# Altium schematic sheet 01_TOP.SchDoc
size A4
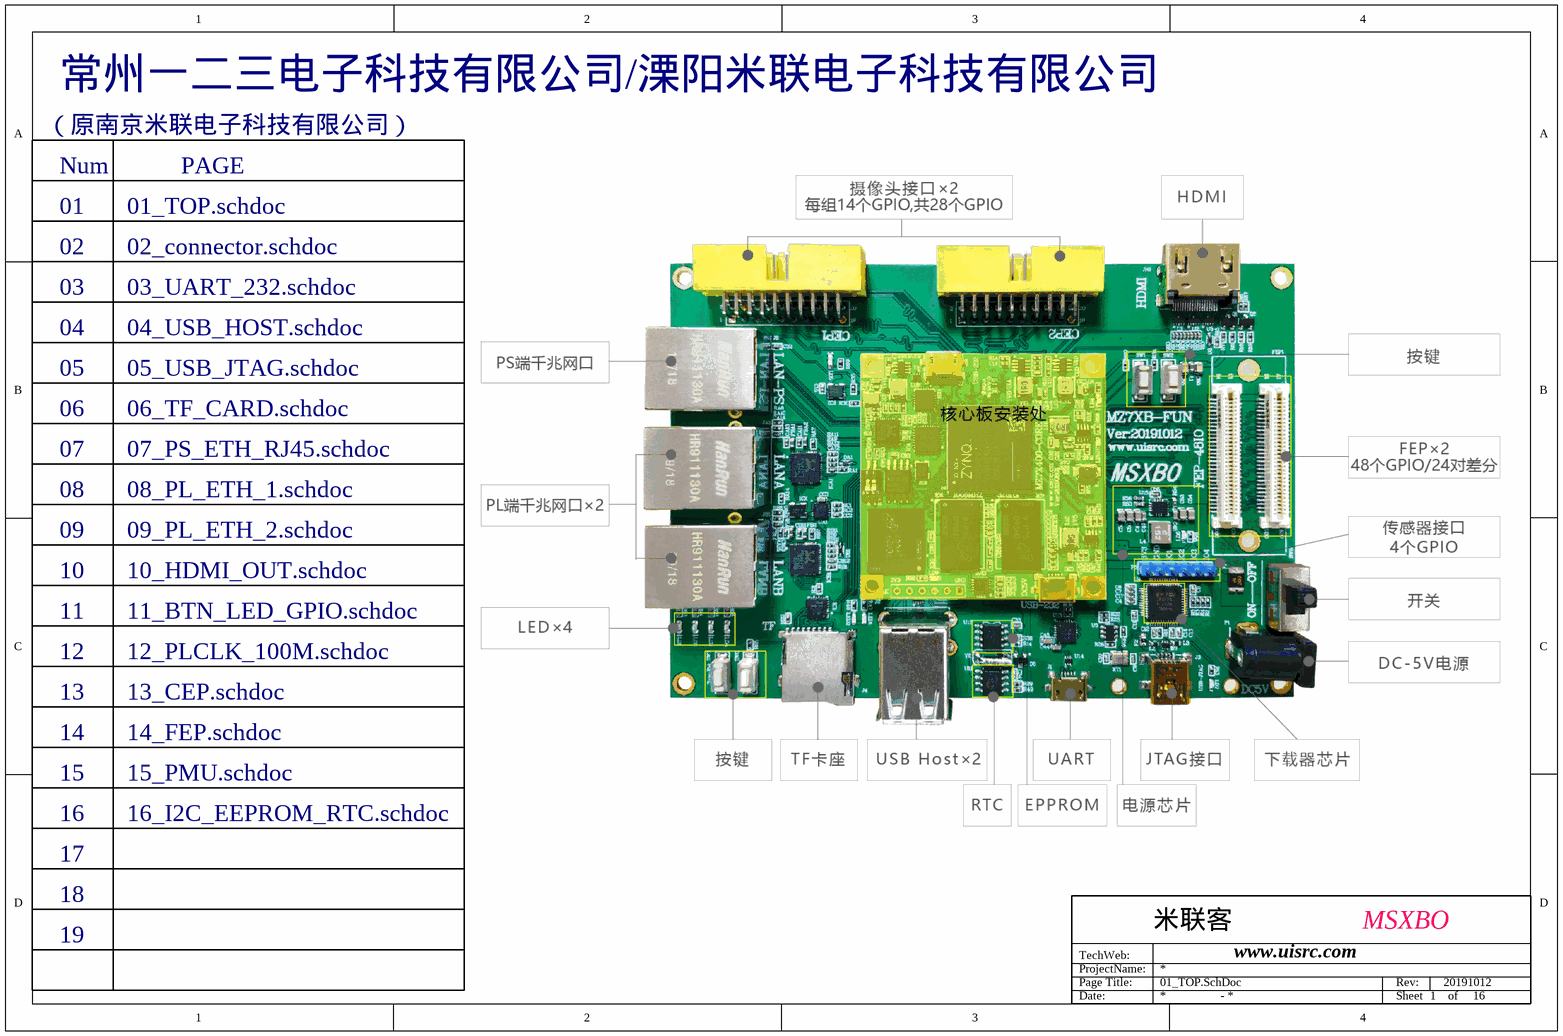
[diagram p0: 01_TOP.SchDoc]

## Notes on the sheet
- 常州一二三电子科技有限公司/溧阳米联电子科技有限公司
- （原南京米联电子科技有限公司）
- Num
- PAGE
- 01
- 01_TOP.schdoc
- 02
- 03
- 02_connector.schdoc
- 03_UART_232.schdoc
- 04
- 05
- 04_USB_HOST.schdoc
- 05_USB_JTAG.schdoc
- 06
- 06_TF_CARD.schdoc
- 07
- 08
- 07_PS_ETH_RJ45.schdoc
- 08_PL_ETH_1.schdoc
- 09
- 10
- 10_HDMI_OUT.schdoc
- 09_PL_ETH_2.schdoc
- 11
- 11_BTN_LED_GPIO.schdoc
- 12
- 13
- 13_CEP.schdoc
- 12_PLCLK_100M.schdoc
- 14
- 15
- 14_FEP.schdoc
- 15_PMU.schdoc
- 16
- 16_I2C_EEPROM_RTC.schdoc
- 17
- 18
- 19
- ProjectName:
- TechWeb:
- Page Title:
- 米联客
- www.uisrc.com
- MSXBO
- Rev:
- 20191012
- Date:
- -
- Sheet
- 1    of     16